# Altium schematic sheet Display.SchDoc
size A4; SheetNumber: 4; SheetTotal: 7
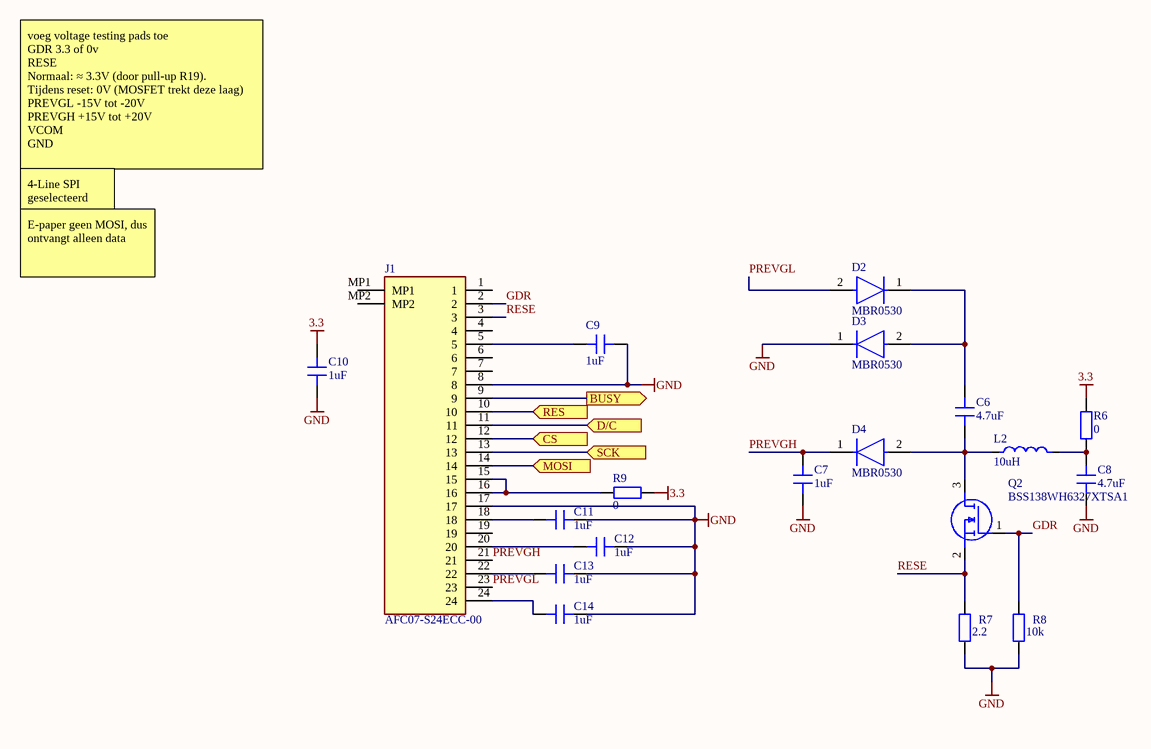
[diagram p0: Display.SchDoc]

## Parts
C6  4.7uF  [0603_CAP]
C7  1uF  [0603_CAP]
C8  4.7uF  [0603_CAP]
C9  1uF  [0603_CAP]
C10  1uF  [0603_CAP]
C11  1uF  [0603_CAP]
C12  1uF  [0603_CAP]
C13  1uF  [0603_CAP]
C14  1uF  [0603_CAP]
D2  MBR0530  [SOD3716X135N]
D3  MBR0530  [SOD3716X135N]
D4  MBR0530  [SOD3716X135N]
J1  AFC07-S24ECC-00  [AFC07S24ECC00]
L2  10uH  [NRS5040T3R3NMGJV]
Q2  BSS138WH6327XTSA1  [SOT65P210X110-3N]
R6  0  [0603]
R7  2.2  [0402_RES]
R8  10k  [0402_RES]
R9  0  [0603]

## Ports
BUSY (out, see Smart-Watch-Front[4B]), CS (in, see Smart-Watch-Front[3C]), D/C (in, see Smart-Watch-Front[3C]), MOSI (in, see Smart-Watch-Front[3B]), RES (in, see Smart-Watch-Front[3C]), SCK (in, see Smart-Watch-Front[3B])

## Nets
3.3: C10.2 R6.1 R9.1
GND: C7.1 C8.1 C9.1 C10.1 C11.2 C12.2 C13.2 C14.2 D3.1(C) J1.8 J1.17 R7.1 R8.2
BUSY: J1.9 ; port BUSY
CS: J1.12 ; port CS
D/C: J1.11 ; port D/C
GDR: J1.2 Q2.1(G) R8.1
MOSI: J1.14 ; port MOSI
PREVGH: C7.2 D4.1(C) J1.21
PREVGL: D2.2(A) J1.23
RES: J1.10 ; port RES
RESE: J1.3 Q2.2(S) R7.2
SCK: J1.13 ; port SCK
NetC6_1: C6.1 D4.2(A) L2.1 Q2.3(D)
NetC6_2: C6.2 D2.1(C) D3.2(A)
NetC8_2: C8.2 L2.2 R6.2
NetC9_2: C9.2 J1.5
NetC11_1: C11.1 J1.18
NetC12_1: C12.1 J1.20
NetC13_1: C13.1 J1.22
NetC14_1: C14.1 J1.24
NetJ1_15: J1.15 J1.16 R9.2

Not connected (* = marked no-connect by the designer): J1 1 4 6 7 19 MP1 MP2

## Notes on the sheet
- voeg voltage testing pads toe
  GDR 3.3 of 0v
  RESE
  Normaal: ≈ 3.3V (door pull-up R19).
  Tijdens reset: 0V (MOSFET trekt deze laag)
  PREVGL -15V tot -20V
  PREVGH +15V tot +20V
  VCOM
  GND
  in datsheet ic: SSD1681
- 4-Line SPI geselecteerd met pin 8 GND
- E-paper geen MOSI, dus ontvangt alleen data

## Library data of the parts
C6-C14 = C
D2-D4 = CMP-00030-46456310-1: 1N4148W-G3-08 Rectifier Diode, 1 Phase, 1 Element, 0.15A, 100V V(RRM), Silicon; Forward Current: 150mA; Reverse Recovery Time: 4ns; Peak Non-Repetitive Surge Current: 500mA; Element Configuration: Single; Forward Voltage: 1.2V; Max Reverse Voltage (DC): 75V; Schedule B: 8541100070, 8541100070|8541100070|8541100070|8541100070|8541100070; Max Repetitive Reverse Voltage (Vrrm): 100V; Weight: 9.412042mg; NexarPartId: 46456310; Contact Plating: Tin; Max Operating Temperature: 150°C; Case/Package: SOD; Mount: Surface Mount; RoHS: Compliant; Min Operating Temperature: -55°C; Average Rectified Current: 150mA; Number of Pins: 2
J1 = AFC07-S24ECC-00: Connector; Manufacturer_Name: JUSHUO; Datasheet Link: https://datasheet.lcsc.com/szlcsc/1811021340_JUSHUO-AFC07-S24ECC-00_C11092.pdf; Height: 2mm; Manufacturer_Part_Number: AFC07-S24ECC-00
L2 = coil
Q2 = BSS138WH6327XTSA1: MOSFET (N-Channel); Manufacturer_Name: Infineon; Datasheet Link: https://www.infineon.com/dgdl/Infineon-BSS138W-DS-v02_43-en.pdf?fileId=db3a304335113a6301351e62fcb4131f; Height: 1mm; Manufacturer_Part_Number: BSS138WH6327XTSA1; Mouser Part Number: 726-BSS138WH6327XTSA; Mouser Price/Stock: https://www.mouser.co.uk/ProductDetail/Infineon-Technologies/BSS138WH6327XTSA1?qs=Dj8dEyEphkMUJZog1oMAlA%3D%3D; Arrow Part Number: BSS138WH6327XTSA1; Arrow Price/Stock: https://www.arrow.com/en/products/bss138wh6327xtsa1/infineon-technologies-ag?utm_currency=USD&region=europe
R6-R9 = R